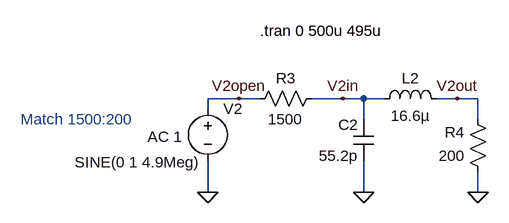
[diagram p0: schematic LC Matching Network.asc]
LC Matching Network.asc, the LTspice schematic file:
Version 4
SHEET 1 880 680
WIRE -112 464 -160 464
WIRE -80 464 -112 464
WIRE 48 464 0 464
WIRE 80 464 48 464
WIRE 112 464 80 464
WIRE 224 464 192 464
WIRE 256 464 224 464
WIRE -160 480 -160 464
WIRE 80 496 80 464
WIRE 256 496 256 464
WIRE -160 608 -160 560
WIRE 80 608 80 560
WIRE 256 608 256 576
FLAG 80 608 0
FLAG 256 608 0
FLAG -160 608 0
FLAG -112 464 V2open
FLAG 48 464 V2in
FLAG 224 464 V2out
SYMBOL ind 96 480 R270
WINDOW 0 32 56 VTop 2
WINDOW 3 5 56 VBottom 2
SYMATTR InstName L2
SYMATTR Value 16.6µ
SYMBOL cap 96 560 R180
WINDOW 0 24 56 Left 2
WINDOW 3 24 8 Left 2
SYMATTR InstName C2
SYMATTR Value 55.2p
SYMBOL res 16 448 R90
WINDOW 0 0 56 VBottom 2
WINDOW 3 32 56 VTop 2
SYMATTR InstName R3
SYMATTR Value 1500
SYMBOL res 272 592 R180
WINDOW 0 36 76 Left 2
WINDOW 3 36 40 Left 2
SYMATTR InstName R4
SYMATTR Value 200
SYMBOL voltage -160 464 R0
WINDOW 3 -205 98 Left 2
WINDOW 123 -93 59 Left 2
WINDOW 39 0 0 Left 2
SYMATTR InstName V2
SYMATTR Value SINE(0 1 4.9Meg)
SYMATTR Value2 AC 1
TEXT -80 360 Left 2 !.tran 0 500u 495u
TEXT -448 496 Left 2 ;Match 1500:200

The netlist it stands for:
* LC Matching Network.asc
L2 V2in V2out 16.6µ
C2 0 V2in 55.2p
R3 V2in V2open 1500
R4 0 V2out 200
V2 V2open 0 SINE(0 1 4.9Meg) AC 1
.tran 0 500u 495u
* Match 1500:200
.backanno
.end